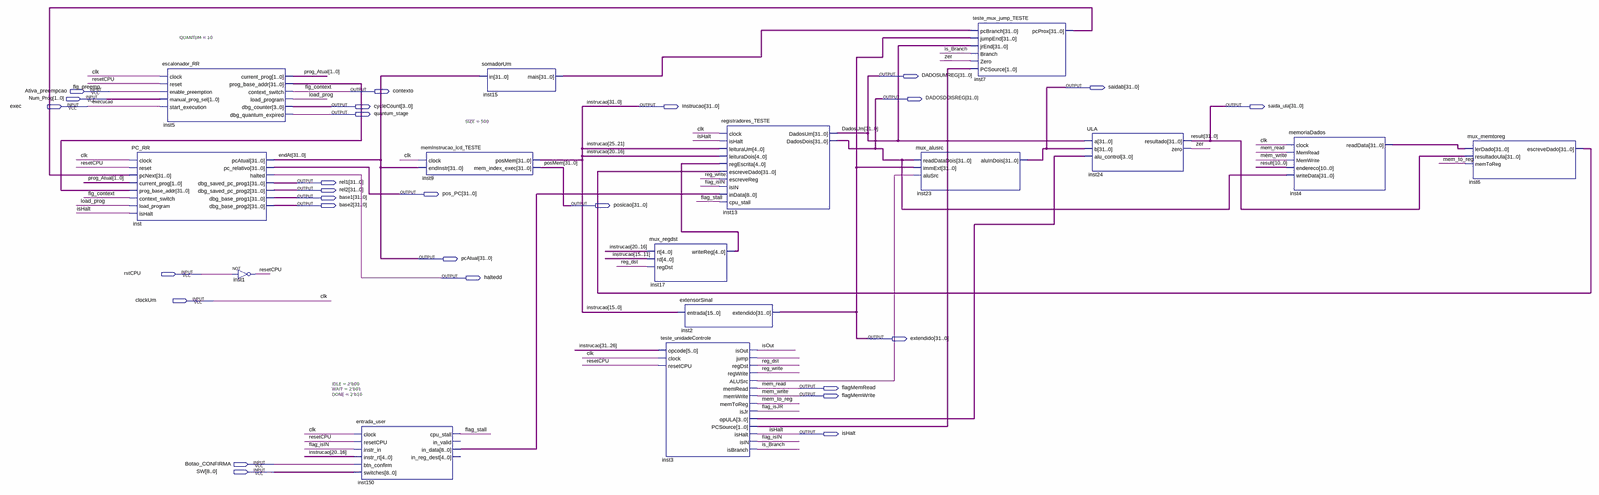
[diagram p0: schematic sheet, whole]
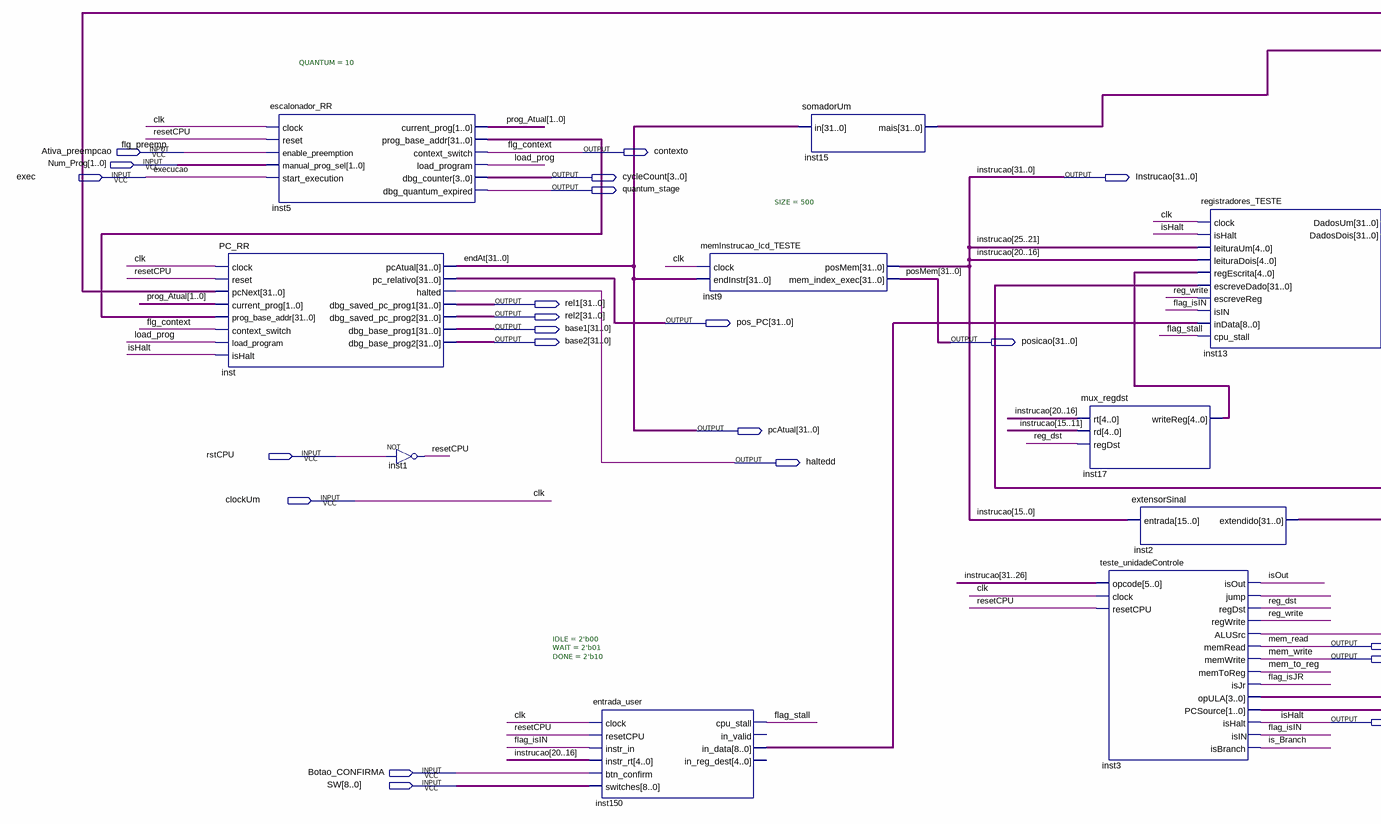
[diagram p1: schematic sheet, left part]
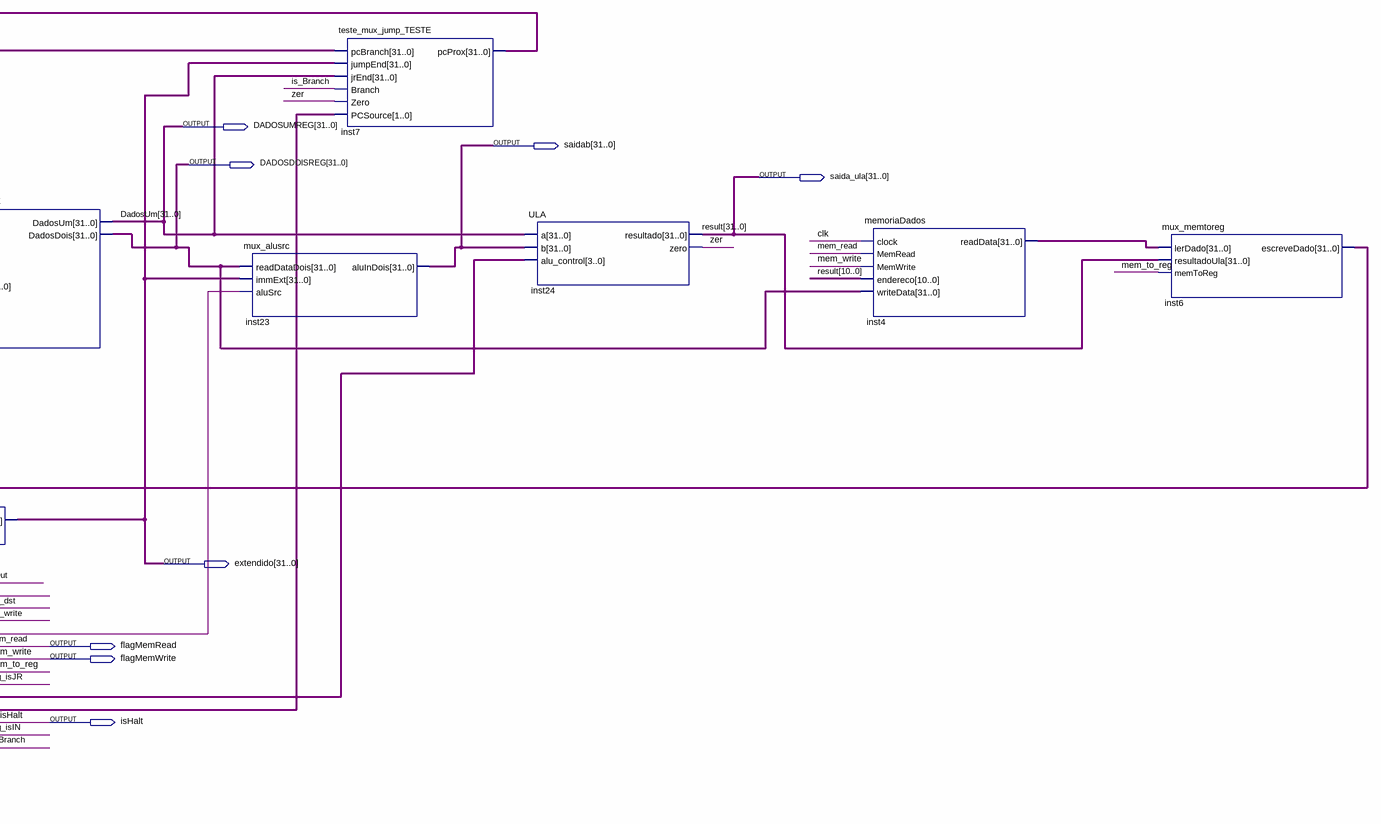
[diagram p2: schematic sheet, right part]
// Quartus schematic teste_Escalona_E_Progs_TESTE.bdf as structural Verilog: 15 symbols, 27 pins
module teste_Escalona_E_Progs_TESTE (
  input  Ativa_preempcao,
  input  [1:0] Num_Prog,
  input  exec,
  input  rstCPU,
  input  clockUm,
  input  Botao_CONFIRMA,
  input  [8:0] SW,
  output [31:0] DADOSUMREG,
  output [31:0] saidab,
  output contexto,
  output [31:0] DADOSDOISREG,
  output [3:0] cycleCount,
  output [31:0] Instrucao,
  output [31:0] saida_ula,
  output quantum_stage,
  output [31:0] rel1,
  output [31:0] rel2,
  output [31:0] pos_PC,
  output [31:0] base1,
  output [31:0] base2,
  output [31:0] posicao,
  output [31:0] pcAtual,
  output haltedd,
  output [31:0] extendido,
  output flagMemRead,
  output flagMemWrite,
  output isHalt
);

  wire flag_isIN, flag_isJR, flag_stall, inst3_alusrc, inst3_jump, is_Branch, isOut, load_prog, mem_to_reg,
       reg_dst, reg_write, resetCPU, zer;
  wire [1:0] inst3_pcsource, prog_Atual;
  wire [3:0] inst3_opula;
  wire [4:0] inst17_writereg;
  wire [8:0] inst150_in_data;
  wire [31:0] inst4_readdata, inst5_prog_base_addr, inst6_escrevedado, inst7_pcprox, inst15_mais;

  PC_RR inst (
    .clock(clockUm), .reset(resetCPU), .pcNext(inst7_pcprox), .current_prog(prog_Atual),
    .prog_base_addr(inst5_prog_base_addr), .context_switch(contexto), .load_program(load_prog),
    .isHalt(isHalt), .pcAtual(pcAtual), .pc_relativo(pos_PC), .halted(haltedd), .dbg_saved_pc_prog1(rel1),
    .dbg_saved_pc_prog2(rel2), .dbg_base_prog1(base1), .dbg_base_prog2(base2));
  escalonador_RR #(.QUANTUM(10)) inst5 (
    .clock(clockUm), .reset(resetCPU), .enable_preemption(Ativa_preempcao), .manual_prog_sel(Num_Prog),
    .start_execution(exec), .current_prog(prog_Atual), .prog_base_addr(inst5_prog_base_addr),
    .context_switch(contexto), .load_program(load_prog), .dbg_counter(cycleCount),
    .dbg_quantum_expired(quantum_stage));
  not inst1 (resetCPU, rstCPU);
  entrada_user #(.IDLE(2'b00), .WAIT(2'b01), .DONE(2'b10)) inst150 (
    .clock(clockUm), .resetCPU(resetCPU), .instr_in(flag_isIN), .instr_rt(Instrucao[20:16]),
    .btn_confirm(Botao_CONFIRMA), .switches(SW), .cpu_stall(flag_stall), .in_data(inst150_in_data));  // open: in_valid, in_reg_dest
  memInstrucao_lcd_TESTE #(.SIZE(500)) inst9 (
    .clock(clockUm), .endInstr(pcAtual), .posMem(Instrucao), .mem_index_exec(posicao));
  somadorUm inst15 (.in(pcAtual), .mais(inst15_mais));
  mux_regdst inst17 (.rt(Instrucao[20:16]), .rd(Instrucao[15:11]), .regDst(reg_dst), .writeReg(inst17_writereg));
  extensorSinal inst2 (.entrada(Instrucao[15:0]), .extendido(extendido));
  teste_unidadeControle inst3 (
    .opcode(Instrucao[31:26]), .clock(clockUm), .resetCPU(resetCPU), .isOut(isOut), .jump(inst3_jump),
    .regDst(reg_dst), .regWrite(reg_write), .ALUSrc(inst3_alusrc), .memRead(flagMemRead),
    .memWrite(flagMemWrite), .memToReg(mem_to_reg), .isJr(flag_isJR), .opULA(inst3_opula),
    .PCSource(inst3_pcsource), .isHalt(isHalt), .isIN(flag_isIN), .isBranch(is_Branch));
  registradores_TESTE inst13 (
    .clock(clockUm), .isHalt(isHalt), .leituraUm(Instrucao[25:21]), .leituraDois(Instrucao[20:16]),
    .regEscrita(inst17_writereg), .escreveDado(inst6_escrevedado), .escreveReg(reg_write), .isIN(flag_isIN),
    .inData(inst150_in_data), .cpu_stall(flag_stall), .DadosUm(DADOSUMREG), .DadosDois(DADOSDOISREG));
  mux_alusrc inst23 (.readDataDois(DADOSDOISREG), .immExt(extendido), .aluSrc(inst3_alusrc), .aluInDois(saidab));
  teste_mux_jump_TESTE inst7 (
    .pcBranch(inst15_mais), .jumpEnd(extendido), .jrEnd(DADOSUMREG), .Branch(is_Branch), .Zero(zer),
    .PCSource(inst3_pcsource), .pcProx(inst7_pcprox));
  ULA inst24 (.a(DADOSUMREG), .b(saidab), .alu_control(inst3_opula), .resultado(saida_ula), .zero(zer));
  memoriaDados inst4 (
    .clock(clockUm), .MemRead(flagMemRead), .MemWrite(flagMemWrite), .endereco(saida_ula[10:0]),
    .writeData(DADOSDOISREG), .readData(inst4_readdata));
  mux_memtoreg inst6 (
    .lerDado(inst4_readdata), .resultadoUla(saida_ula), .memToReg(mem_to_reg), .escreveDado(inst6_escrevedado));

  // Other names for the same wires on the sheet: clk = clockUm; DadosUm[31:0] = DADOSUMREG; endAt[31:0] = pcAtual;
  //   execucao = exec; flg_context = contexto; flg_preemp = Ativa_preempcao; mem_read = flagMemRead;
  //   mem_write = flagMemWrite; posMem[31:0] = posicao; result[31:0] = saida_ula
endmodule
